# Altium schematic sheet MCU.SchDoc: MCU
size A4; DrawnBy: Grzegorz Gajoch; Address1: Grzegorz Gajoch; Address2: grzegorz@gajoch.pl; Revision: 1
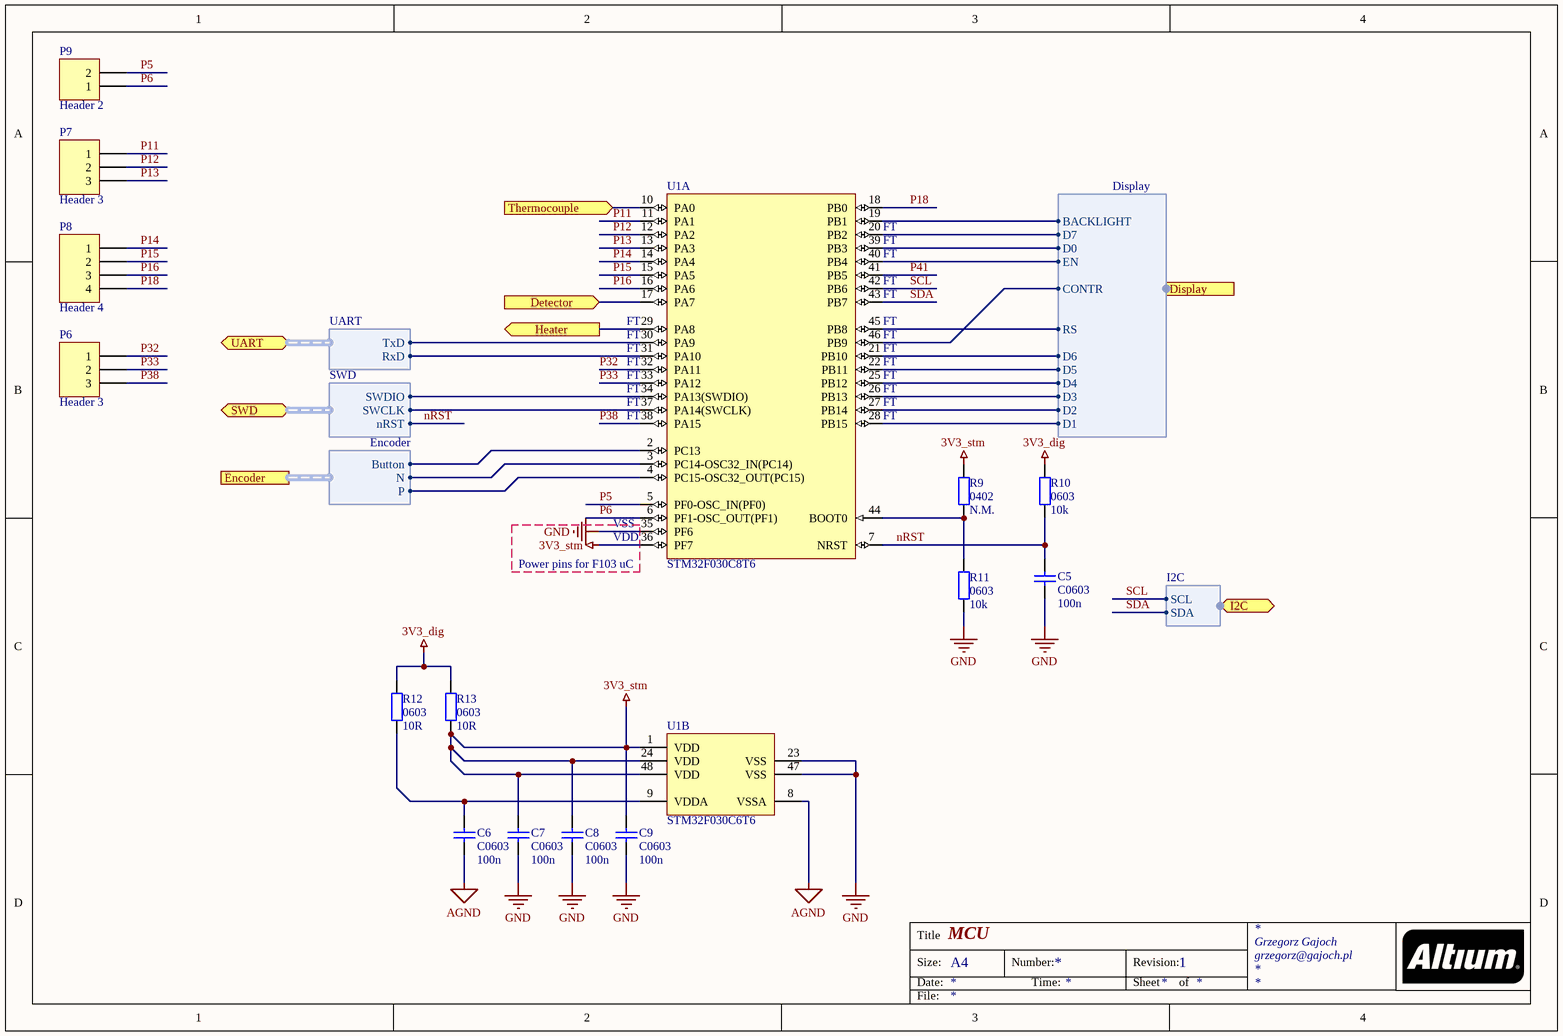
[diagram p0: MCU.SchDoc]

## Parts
C5  100n  [C0603]
C6  100n  [C0603]
C7  100n  [C0603]
C8  100n  [C0603]
C9  100n  [C0603]
P6  Header 3  [HEADER 1X3 MALE]
P7  Header 3  [HEADER 1X3 MALE]
P8  Header 4  [HEADER 1x4 MALE]
P9  Header 2  [HEADER 1X2 Male]
R9  N.M.  [0402]
R10  10k  [0603]
R11  10k  [0603]
R12  10R  [0603]
R13  10R  [0603]
U1  STM32F030C8T6  [QFP_48_0.5_M]  (parts A,B of 2)

## Ports
Detector (in), Display (harness Display), Encoder (harness Encoder), Heater (out), I2C (harness I2C), SWD (harness SWD), Thermocouple (in), UART (harness UART)

## Harnesses
SWD: SWDIO, SWCLK, nRST
Display: CONTR, RS, EN, D0, D1, D2, D3, D4, D5, D6, D7, BACKLIGHT
UART: RxD, TxD
Encoder: Button, P, N
I2C: SCL, SDA

## Nets
3V3_dig: R10.1 R12.1 R13.1
3V3_stm: C7.1 C8.1 C9.1 R9.1 R13.2 U1.1(VDD) U1.24(VDD) U1.36(PF7) U1.48(VDD)
AGND: C6.2 U1.8(VSSA)
GND: C5.2 C7.2 C8.2 C9.2 R11.2 U1.23(VSS) U1.35(PF6) U1.47(VSS)
Detector: U1.17(PA7) ; port Detector
Heater: U1.29(PA8) ; port Heater
nRST: C5.1 R10.2 U1.7(NRST) ; port SWD.nRST
P5: P9.2 U1.5(PF0-OSC_IN(PF0))
P6: P9.1 U1.6(PF1-OSC_OUT(PF1))
P11: P7.1 U1.11(PA1)
P12: P7.2 U1.12(PA2)
P13: P7.3 U1.13(PA3)
P14: P8.1 U1.14(PA4)
P15: P8.2 U1.15(PA5)
P16: P8.3 U1.16(PA6)
P18: P8.4 U1.18(PB0)
P32: P6.1 U1.32(PA11)
P33: P6.2 U1.33(PA12)
P38: P6.3 U1.38(PA15)
P41: U1.41(PB5)
SCL: U1.42(PB6) ; port I2C.SCL
SDA: U1.43(PB7) ; port I2C.SDA
Thermocouple: U1.10(PA0) ; port Thermocouple
NetC6_1: C6.1 R12.2 U1.9(VDDA)
NetR9_2: R9.2 R11.1 U1.44(BOOT0)
NetU1_2: U1.2(PC13) ; port Encoder.Button
NetU1_3: U1.3(PC14-OSC32_IN(PC14)) ; port Encoder.N
NetU1_4: U1.4(PC15-OSC32_OUT(PC15)) ; port Encoder.P
NetU1_19: U1.19(PB1) ; port Display.BACKLIGHT
NetU1_20: U1.20(PB2) ; port Display.D7
NetU1_21: U1.21(PB10) ; port Display.D6
NetU1_22: U1.22(PB11) ; port Display.D5
NetU1_25: U1.25(PB12) ; port Display.D4
NetU1_26: U1.26(PB13) ; port Display.D3
NetU1_27: U1.27(PB14) ; port Display.D2
NetU1_28: U1.28(PB15) ; port Display.D1
NetU1_30: U1.30(PA9) ; port UART.TxD
NetU1_31: U1.31(PA10) ; port UART.RxD
NetU1_34: U1.34(PA13(SWDIO)) ; port SWD.SWDIO
NetU1_37: U1.37(PA14(SWCLK)) ; port SWD.SWCLK
NetU1_39: U1.39(PB3) ; port Display.D0
NetU1_40: U1.40(PB4) ; port Display.EN
NetU1_45: U1.45(PB8) ; port Display.RS
NetU1_46: U1.46(PB9) ; port Display.CONTR

## Notes on the sheet
- (near U1) FT
- (near U1) Power pins for F103 uC
- (near U1) VSS
- (near U1) VDD
- Title
- Size:
- Date:
- A4
- Number:
- Time:
- Revision:
- Sheet
- of
- File:

## Library data of the parts
C5-C9 = Cap: Generic capacitor; Packge: C0603; Value: 100n
P6 P7 = Header 3: Header, 3-Pin; LatestRevisionDate: 17-Jul-2002; LatestRevisionNote: Re-released for DXP Platform.; Publisher: Altium Limited
P8 = Header 4: Header, 4-Pin; LatestRevisionDate: 17-Jul-2002; LatestRevisionNote: Re-released for DXP Platform.; Publisher: Altium Limited
P9 = Header 2: Header, 2-Pin; LatestRevisionDate: 17-Jul-2002; LatestRevisionNote: Re-released for DXP Platform.; Publisher: Altium Limited
R9-R13 = Res: Generic resistor
  R9: Package: 0402; Value: N.M.
  R10 R11: Package: 0603; Value: 10k
  R12 R13: Package: 0603; Value: 10R
U1 = STM32F030C6T6: ARM Cortex-M0 32-bit MCU, 32 KB Flash, 4 KB Internal RAM, 39 I/Os, 48-pin LQFP, -40 to 85 degC, Tray; FLASH Size (Prog) (kB): 32; I/Os (High Current): 39; Internal RAM Size (kB): 4; Operating Frequency(F) (Processor speed) (MHz): 48; Supply Voltage(Vcc) min (V): 2.4; DatasheetVersion: Rev. 1; PackageVersion: Rev. 6, 06/2013; PackageReference: LQFP48; PackageDescription: 48-Pin Low Profile Quad Flat Package, 7 x 7 mm Body, 0.5 mm Pitch; Supplier 1: Digi-Key; Supplier Part Number 1: 497-14042-ND; Supplier 2: Newark; Supplier Part Number 2: 06X3646; Supplier 3: Mouser; Supplier Part Number 3: 511-STM32F030C6T6; Core: ARM Cortex-M0; Packing: Tray; Mounting Technology: Surface Mount; PartNumber: STM32F030C6T6; ComponentLink1Description: Manufacturer URL; ComponentLink1URL: http://www.st.com/web/en/home.html; ComponentLink2Description: Datasheet; ComponentLink2URL: http://www.st.com/st-web-ui/static/active/en/resource/technical/document/datasheet/DM00088500.pdf; ComponentLink3Description: Package Specification; ComponentLink3URL: http://www.st.com/st-web-ui/static/active/en/resource/technical/document/datasheet/DM00058181.pdf